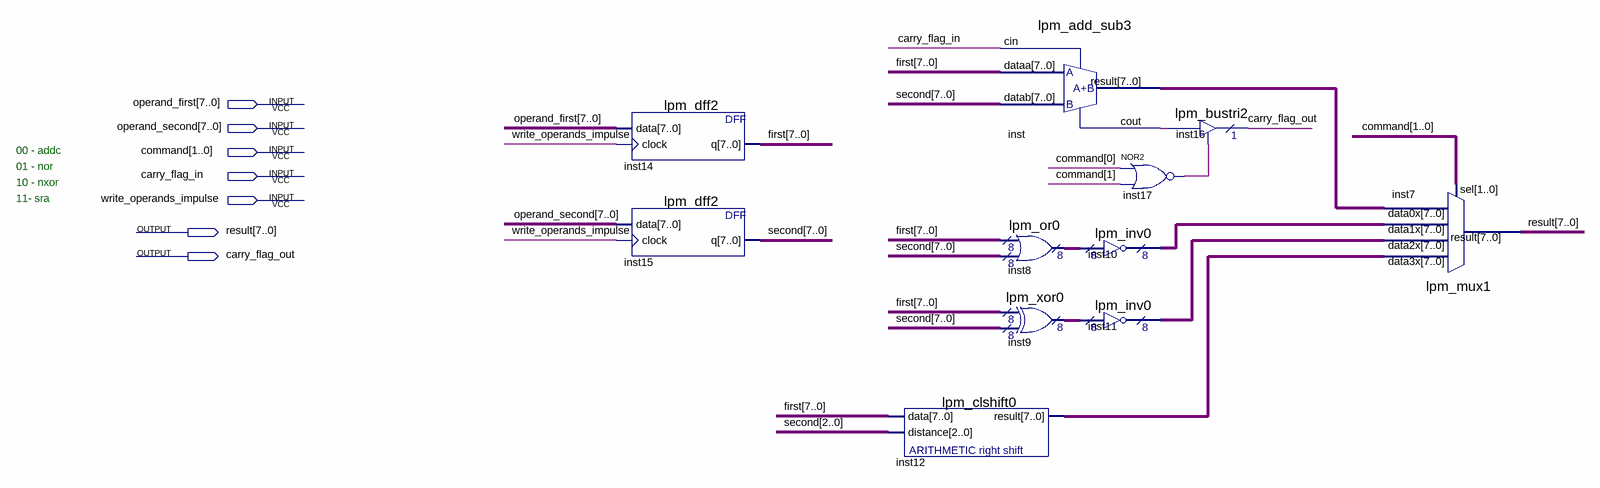
[diagram p0: schematic sheet]
// Quartus schematic ALU.bdf as structural Verilog: 11 symbols, 7 pins
module ALU (
  input  [7:0] operand_first,
  input  [7:0] operand_second,
  input  [1:0] command,
  input  carry_flag_in,
  input  write_operands_impulse,
  output [7:0] result,
  output carry_flag_out
);

  wire inst17_out, inst_cout;
  wire [7:0] first, inst8_result, inst9_result, inst10_result, inst11_result, inst12_result, inst_result,
       second;

  lpm_dff2 inst14 (.data(operand_first), .clock(write_operands_impulse), .q(first));
  lpm_dff2 inst15 (.data(operand_second), .clock(write_operands_impulse), .q(second));
  lpm_clshift0 inst12 (.data(first), .distance(second[2:0]), .result(inst12_result));
  lpm_add_sub3 inst (.dataa(first), .datab(second), .cin(carry_flag_in), .result(inst_result), .cout(inst_cout));
  lpm_or0 inst8 (.data0x(first), .data1x(second), .result(inst8_result));
  lpm_xor0 inst9 (.data0x(first), .data1x(second), .result(inst9_result));
  lpm_inv0 inst10 (.data(inst8_result), .result(inst10_result));
  lpm_inv0 inst11 (.data(inst9_result), .result(inst11_result));
  nor inst17 (inst17_out, command[0], command[1]);
  lpm_bustri2 inst16 (.enabledt(inst17_out), .data(inst_cout), .tridata(carry_flag_out));
  lpm_mux1 inst7 (
    .data3x(inst12_result), .data2x(inst11_result), .data1x(inst10_result), .data0x(inst_result),
    .sel(command), .result(result));

  // Notes on the sheet:
  //   00 - addc
  //   01 - nor
  //   10 - nxor
  //   11- sra
endmodule
